# EAGLE schematic RFM69Pi_V5 (EAGLE 9.2.2)
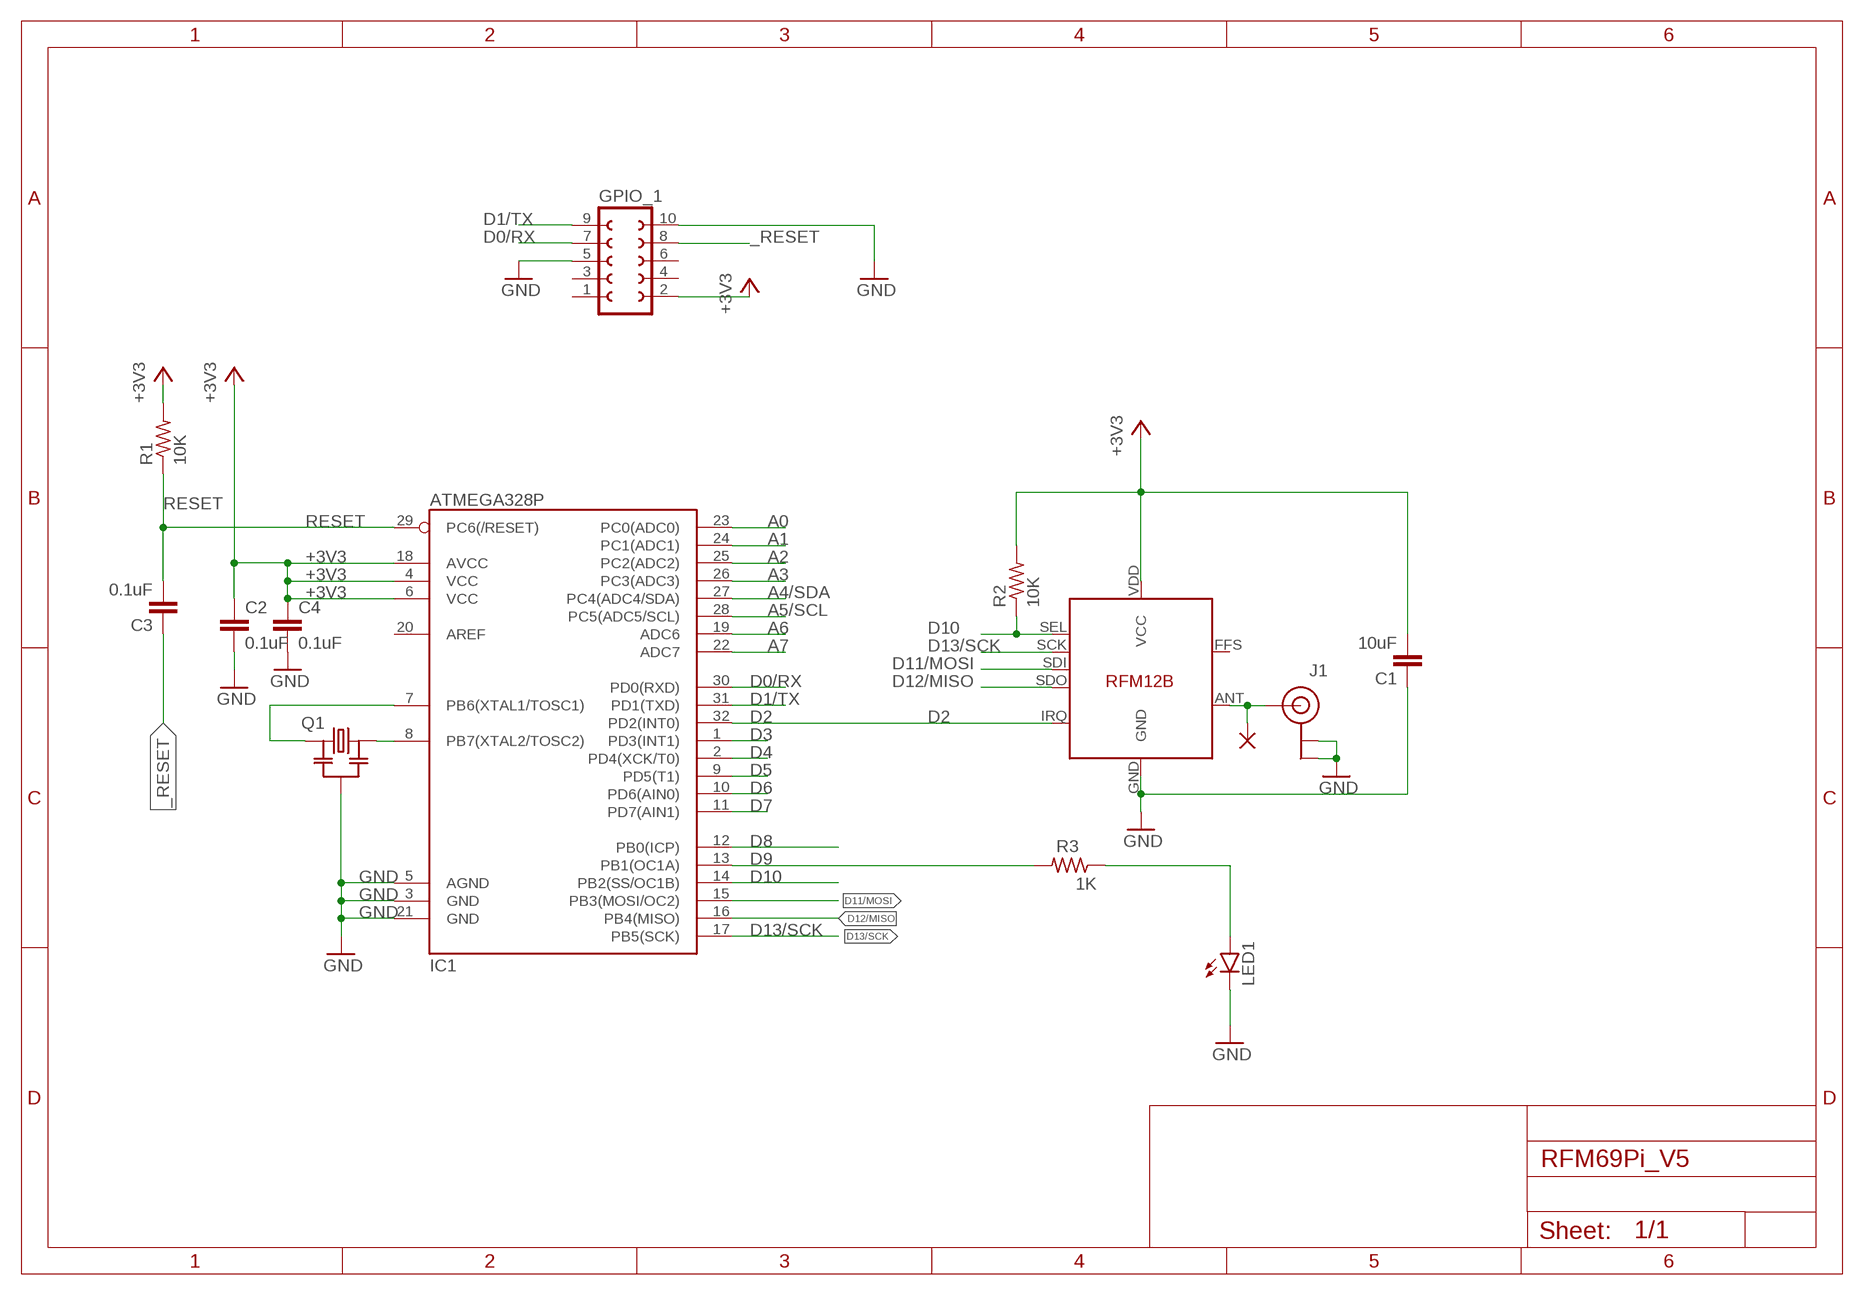
[diagram p0: schematic, sheet 1]

## Parts
C1  10uF  C-EUC0603  [C0603]
C2  0.1uF  C-EUC0603  [C0603]
C3  0.1uF  C-EUC0603  [C0603]
C4  0.1uF  C-EUC0603  [C0603]
GPIO_1  CON-LSTA_FE05-2  [CON-LSTA_FE05-2]
IC1  ATMEGA328P  ATMEGA168  [TQFP32-08]
J1  U.FL  [U.FL]
LED1  LEDSML0603  [SML0603]
PAD2  1,6/0,8  [1,6/0,8]
Q1  RESONATOR-MURATACST_CE  [RESONATOR_MURATA2]
R1  10K  R-US_R0603  [R0603]
R2  10K  R-US_R0603  [R0603]
R3  1K  R-US_R0603  [R0603]
RFM69CW  RFM69CW  RFM12B  [RFM12B]

## Nets
+3V3 [power]: C1.2 C2.1 C4.1 GPIO_1.2 IC1.4(VCC) IC1.6(VCC) IC1.18(AVCC) R1.2 R2.2 RFM69CW.VDD(VCC)
_RESET: C3.1 GPIO_1.8
A0: IC1.23(PC0(ADC0))
A1: IC1.24(PC1(ADC1))
A2: IC1.25(PC2(ADC2))
A3: IC1.26(PC3(ADC3))
A4/SDA: IC1.27(PC4(ADC4/SDA))
A5/SCL: IC1.28(PC5(ADC5/SCL))
A6: IC1.19(ADC6)
A7: IC1.22(ADC7)
D0/RX: GPIO_1.7 IC1.30(PD0(RXD))
D1/TX: GPIO_1.9 IC1.31(PD1(TXD))
D2: IC1.32(PD2(INT0)) RFM69CW.IRQ
D3: IC1.1(PD3(INT1))
D4: IC1.2(PD4(XCK/T0))
D5: IC1.9(PD5(T1))
D6: IC1.10(PD6(AIN0))
D7: IC1.11(PD7(AIN1))
D8: IC1.12(PB0(ICP))
D9: IC1.13(PB1(OC1A)) R3.2
D10: IC1.14(PB2(SS/OC1B)) R2.1 RFM69CW.SEL
D11/MOSI: IC1.15(PB3(MOSI/OC2)) RFM69CW.SDI
D12/MISO: IC1.16(PB4(MISO)) RFM69CW.SDO
D13/SCK: IC1.17(PB5(SCK)) RFM69CW.SCK
GND [power]: C1.1 C2.2 C4.2 GPIO_1.5 GPIO_1.10 IC1.3(GND) IC1.5(AGND) IC1.21(GND) J1.1(GND) J1.2(GND) LED1.C Q1.2 RFM69CW.GND
N$1: IC1.7(PB6(XTAL1/TOSC1)) Q1.1
N$2: IC1.8(PB7(XTAL2/TOSC2)) Q1.3
N$3: LED1.A R3.1
N$6 [power]: J1.FEED(SIGNAL) PAD2.1(P) RFM69CW.ANT
RESET: C3.2 IC1.29(PC6(/RESET)) R1.1
Unconnected: GPIO_1.1 GPIO_1.3 GPIO_1.4 GPIO_1.6 IC1.20(AREF) RFM69CW.FFS

## Library data of the parts
C1-C3 = rcl:C-EU: CAPACITOR, European symbol; SPICEPREFIX: C
C4 = resistor:C-EU: CAPACITOR, European symbol
GPIO_1 = RFM69Pi:CON-LSTA_FE05-2: FEMALE HEADER; OC_FARNELL: unknown; OC_NEWARK: unknown
IC1 = SparkFun:ATMEGA168
J1 = SparkFun-Connectors:U.FL: SMD Antenna Connector - U.FL 2mm height, 3.0mm x 3.0mm receptacle size. SparkFun Products: SparkFun WiFi Shield - ESP8266 <https://www.sparkfun.com/products/13287> SparkFun ESP8266 Thing <https://www.sparkfun.com/products/13231> SparkFun MiniGen - Pro Mini Signal Generator Shield <https://www.sparkfun.com/products/11420>; PROD_ID: CONN-09193; SF_ID: WRL-09144
LED1 = led:LED: LED OSRAM: - CHIPLED LG R971, LG N971, LY N971, LG Q971, LY Q971, LO R971, LY R971 LH N974, LH R974 LS Q976, LO Q976, LY Q976 LO Q996 - Hyper CHIPLED LW Q18S LB Q993, LB Q99A, LB R99A - SideLED LS A670, LO A670, LY A670, LG A670, LP A670 LB A673, LV A673, LT A673, LW A673 LH A674 LY A675 LS A676, LA A676, LO A676, LY A676, LW A676 LS A679, LY A679, LG A679 - Hyper Micro SIDELED® LS Y876, LA Y876, LO Y876, LY Y876 LT Y87S - SmartLED LW L88C, LW L88S LB L89C, LB L89S, LG L890 LS L89K, LO L89K, LY L89K LS L896, LA L896, LO L896, LY L896 - TOPLED LS T670, LO T670, LY T670, LG T670, LP T670 LSG T670, LSP T670, LSY T670, LOP T670, LYG T670 LG T671, LOG T671, LSG T671 LB T673, LV T673, LT T673, LW T673 LH T674 LS T676, LA T676, LO T676, LY T676, LB T676, LH T676, LSB T676, LW T676 LB T67C, LV T67C, LT T67C, LS T67K, LO T67K, LY T67K, LW E67C LS E67B, LA E67B, LO E67B, LY E67B, LB E67C, LV E67C, LT E67C LW T67C LS T679, LY T679, LG T679 LS T770, LO T770, LY T770, LG T770, LP T770 LB T773, LV T773, LT T773, LW T773 LH T774 LS E675, LA E675, LY E675, LS T675 LS T776, LA T776, LO T776, LY T776, LB T776 LHGB T686 LT T68C, LB T68C - Hyper Mini TOPLED® LB M676 - Mini TOPLED Santana® LG M470 LS M47K, LO M47K, LY M47K Source: http://www.osram.convergy.de LUXEON: - LUMILED® LXK2-PW12-R00, LXK2-PW12-S00, LXK2-PW14-U00, LXK2-PW14-V00 LXK2-PM12-R00, LXK2-PM12-S00, LXK2-PM14-U00 LXK2-PE12-Q00, LXK2-PE12-R00, LXK2-PE12-S00, LXK2-PE14-T00, LXK2-PE14-U00 LXK2-PB12-K00, LXK2-PB12-L00, LXK2-PB12-M00, LXK2-PB14-N00, LXK2-PB14-P00, LXK2-PB14-Q00 LXK2-PR12-L00, LXK2-PR12-M00, LXK2-PR14-Q00, LXK2-PR14-R00 LXK2-PD12-Q00, LXK2-PD12-R00, LXK2-PD12-S00 LXK2-PH12-R00, LXK2-PH12-S00 LXK2-PL12-P00, LXK2-PL12-Q00, LXK2-PL12-R00 Source: www.luxeon.com KINGBRIGHT: KA-3528ASYC Source: www.kingbright.com
PAD2 = wirepad:1,6/0,8: THROUGH-HOLE PAD
Q1 = m-pad-2.1:RESONATOR-MURATA: Murata ceramic Resonator "ceralock" CSTCE series with built in load capacitance +- 0.5% tolerance 12.51MHz to 19.99MHz 16MHz murata part#: CSTCE16M0V53-R0 16MHz digikey part#: 490-1198-1-ND $1.33 each
R1-R3 = adafruit:R-US_: RESISTOR, American symbol
RFM69CW = RFM69Pi:RFM12B

## Net classes
0 default: width 0.203 mm, drill 0.203 mm, clearance 0.205 mm
1 power: width 0.254 mm, drill 0.254 mm, clearance 0.205 mm to class 0, clearance 0.254 mm